# Altium schematic sheet [10]-I2C-Switch.SchDoc: I²C-Switch
size A3; Organization: Toradex AG; Address1: Altsagenstrasse 5; Address2: Horw; Address3: 6048; Address4: Switzerland; DocumentNumber: 9; Revision: V3.2; SheetNumber: 9; SheetTotal: 13; PageSetup: Record=PageOptions|CenterHorizontal=True|CenterVertical=True|PrintScale=0.73|XCorrection=1.00|YCorrection=1.00|PrintKind=0|BorderSize=5000000|LeftOffset=0|BottomOffset=0|Orientation=2|PaperLength=1000|PaperWidth=1000|Scale=100|PaperSource=7|PrintQuality=-4|MediaType=1|DitherType=10|PaperKind=A4|PrintScaleMode=1
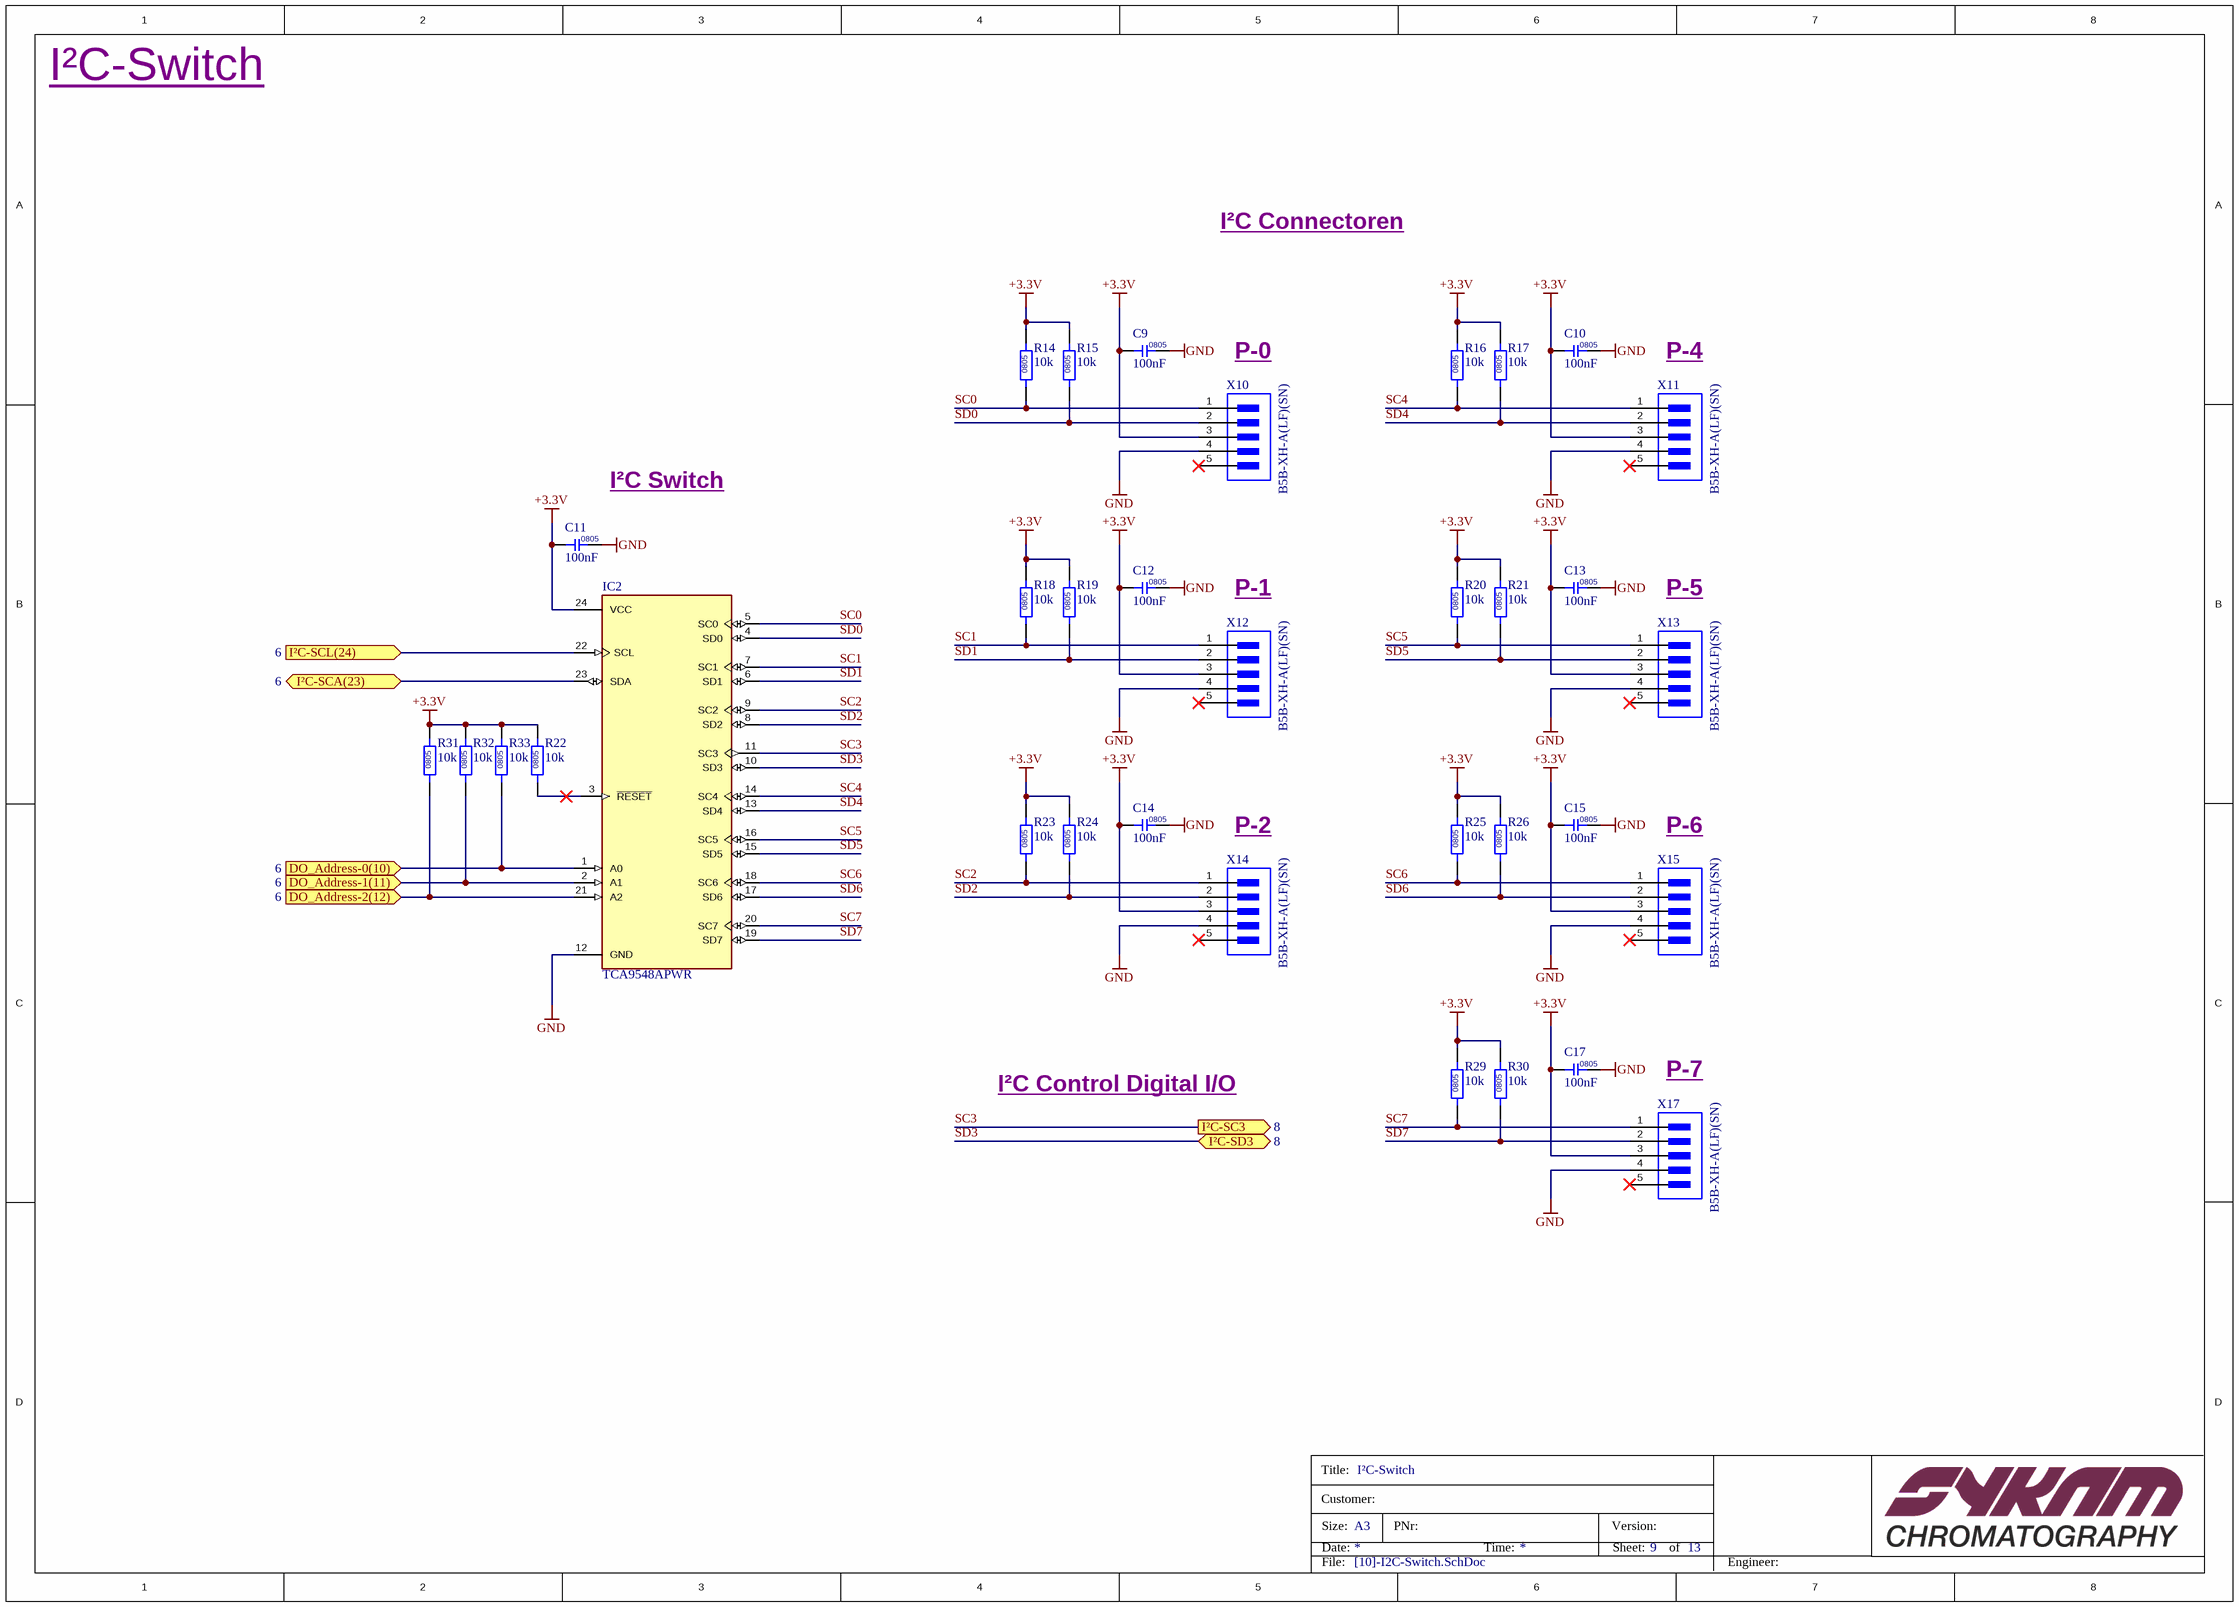
[diagram p0: [10]-I2C-Switch.SchDoc]

## Parts
C9  100nF  [C0805]
C10  100nF  [C0805]
C11  100nF  [C0805]
C12  100nF  [C0805]
C13  100nF  [C0805]
C14  100nF  [C0805]
C15  100nF  [C0805]
C17  100nF  [C0805]
IC2  TCA9548APWR  [IC-TCA9548-TSSOP24]
R14  10k  [R0805]
R15  10k  [R0805]
R16  10k  [R0805]
R17  10k  [R0805]
R18  10k  [R0805]
R19  10k  [R0805]
R20  10k  [R0805]
R21  10k  [R0805]
R22  10k  [R0805]
R23  10k  [R0805]
R24  10k  [R0805]
R25  10k  [R0805]
R26  10k  [R0805]
R29  10k  [R0805]
R30  10k  [R0805]
R31  10k  [R0805]
R32  10k  [R0805]
R33  10k  [R0805]
X10  B5B-XH-A(LF)(SN)  [CON_ B5B-XH-A (LF)(SN)]
X11  B5B-XH-A(LF)(SN)  [CON_ B5B-XH-A (LF)(SN)]
X12  B5B-XH-A(LF)(SN)  [CON_ B5B-XH-A (LF)(SN)]
X13  B5B-XH-A(LF)(SN)  [CON_ B5B-XH-A (LF)(SN)]
X14  B5B-XH-A(LF)(SN)  [CON_ B5B-XH-A (LF)(SN)]
X15  B5B-XH-A(LF)(SN)  [CON_ B5B-XH-A (LF)(SN)]
X17  B5B-XH-A(LF)(SN)  [CON_ B5B-XH-A (LF)(SN)]

## Ports
DO_Address-0(10) (in, see 6), DO_Address-1(11) (in, see 6), DO_Address-2(12) (in, see 6), I²C-SC3 (out, see 8), I²C-SCA(23) (bidir, see 6), I²C-SCL(24) (in, see 6), I²C-SD3 (bidir, see 8)

## Nets
+3.3V: C9.1 C10.1 C11.1 C12.1 C13.1 C14.1 C15.1 C17.1 IC2.24(VCC) R14.2 R15.2 R16.2 R17.2 R18.2 R19.2 R20.2 R21.2 R22.2 R23.2 R24.2 R25.2 R26.2 R29.2 R30.2 R31.2 R32.2 R33.2 X10.3 X11.3 X12.3 X13.3 X14.3 X15.3 X17.3
GND: C9.2 C10.2 C11.2 C12.2 C13.2 C14.2 C15.2 C17.2 IC2.12(GND) X10.4 X11.4 X12.4 X13.4 X14.4 X15.4 X17.4
DO_Address-0(10): IC2.1(A0) R33.1 ; port DO_Address-0(10)
DO_Address-1(11): IC2.2(A1) R32.1 ; port DO_Address-1(11)
DO_Address-2(12): IC2.21(A2) R31.1 ; port DO_Address-2(12)
I²C-SCA(23): IC2.23(SDA) ; port I²C-SCA(23)
I²C-SCL(24): IC2.22(SCL) ; port I²C-SCL(24)
SC0: IC2.5(SC0) R14.1 X10.1
SC1: IC2.7(SC1) R18.1 X12.1
SC2: IC2.9(SC2) R23.1 X14.1
SC3: IC2.11(SC3) ; port I²C-SC3
SC4: IC2.14(SC4) R16.1 X11.1
SC5: IC2.16(SC5) R20.1 X13.1
SC6: IC2.18(SC6) R25.1 X15.1
SC7: IC2.20(SC7) R29.1 X17.1
SD0: IC2.4(SD0) R15.1 X10.2
SD1: IC2.6(SD1) R19.1 X12.2
SD2: IC2.8(SD2) R24.1 X14.2
SD3: IC2.10(SD3) ; port I²C-SD3
SD4: IC2.13(SD4) R17.1 X11.2
SD5: IC2.15(SD5) R21.1 X13.2
SD6: IC2.17(SD6) R26.1 X15.2
SD7: IC2.19(SD7) R30.1 X17.2
NetIC2_3: IC2.3(~{RESET}) R22.1

Not connected (* = marked no-connect by the designer): X10 5*; X11 5*; X12 5*; X13 5*; X14 5*; X15 5*; X17 5*

## Notes on the sheet
- I²C Connectoren
- (near X10) P-0
- (near X11) P-4
- (near C11) I²C Switch
- (near X12) P-1
- (near X13) P-5
- (near X14) P-2
- (near X15) P-6
- I²C Control Digital I/O
- (near X17) P-7
- Title:
- Customer:
- Size:
- Date:
- A3
- PNr:
- Time:
- Version:
- Sheet:
- of
- File:
- Engineer:
- Title
- Number:
- Revision:
- Sheet

## Library data of the parts
C9-C15 C17 = C_100nF_CC0805KRX7R9BB104: CAP CER 0.1UF 50V X7R 0805; Manufacturer: Yageo; Material: Ceramic; Tolerance: 10%; Insulation Resistance: 100GR; PCBChecked: initials after Checked; Supplier 1: Digi-Key; Manufacturer Part Number: CC0805KRX7R9BB104; RoHS: Yes; Category: Ceramic Capacitors; Mount: Surface Mount; Case/Package: 0805; Number of Pins: 2; Case Code (Metric): 2012; Case Code (Imperial): 0805; Min Operating Temperature: -55°C; Max Operating Temperature: 125°C; Packaging: Tape and Reel; Capacitance: 100nF; Voltage Rating: 50V; Package Quantity: 1; Dielectric: X7R; Termination: SMD/SMT; Voltage: 50V; Length: 2mm; Height: 0.85mm; Width: 0.049inch; Thickness: 0.033inch; Depth: 1.25mm; Radiation Hardening: No; REACH SVHC: No SVHC; Lead Free: Lead Free; Halogen Free: Halogen Free; ComponentLink1URL: https://datasheet.ciiva.com/11786/0900766b80d84f1d-11786009.pdf?src-supplier=RSComponents; ComponentLink1Description: https://datasheet.ciiva.com/11786/0900766b80d84f1d-11786009.pdf?src-supplier=RSComponents; ComponentLink2URL: https://datasheet.ciiva.com/11464/upy-gphc-x7r-6-3v-to-50v-8-11464757.pdf?src-supplier=Avnet; ComponentLink2Description: https://datasheet.ciiva.com/11464/upy-gphc-x7r-6-3v-to-50v-8-11464757.pdf?src-supplier=Avnet; ComponentLink3URL: https://datasheet.ciiva.com/28450/1489800-28450805.pdf?src-supplier=Element14; ComponentLink3Description: https://datasheet.ciiva.com/28450/1489800-28450805.pdf?src-supplier=Element14; ComponentLink4URL: https://datasheet.ciiva.com/155/mlccorderingcode-155929.pdf?src-supplier=Digi-Key; ComponentLink4Description: https://datasheet.ciiva.com/155/mlccorderingcode-155929.pdf?src-supplier=Digi-Key; ComponentLink5URL: https://datasheet.ciiva.com/155/mlccorderingcode-155930.pdf?src-supplier=Digi-Key; ComponentLink5Description: https://datasheet.ciiva.com/155/mlccorderingcode-155930.pdf?src-supplier=Digi-Key; ComponentLink6URL: https://datasheet.ciiva.com/155/mlccorderingcode-155931.pdf?src-supplier=Digi-Key; ComponentLink6Description: https://datasheet.ciiva.com/155/mlccorderingcode-155931.pdf?src-supplier=Digi-Key; ComponentLink7URL: https://datasheet.ciiva.com/46393/1734573-46393307.pdf?src-supplier=Element14; ComponentLink7Description: https://datasheet.ciiva.com/46393/1734573-46393307.pdf?src-supplier=Element14; ComponentLink8URL: https://datasheet.ciiva.com/16625/upy-gphc-x7r-6-3v-to-50v-8-16625549.pdf?src-supplier=Avnet+Europe; ComponentLink8Description: https://datasheet.ciiva.com/16625/upy-gphc-x7r-6-3v-to-50v-8-16625549.pdf?src-supplier=Avnet+Europe; ComponentLink9URL: https://datasheet.ciiva.com/29242/445210-da-01-en-kerko-chip-0805-x7r-0-1uf-10proz-50vg-29242074.pdf?src-supplier=Conrad; ComponentLink9Description: https://datasheet.ciiva.com/29242/445210-da-01-en-kerko-chip-0805-x7r-0-1uf-10proz-50vg-29242074.pdf?src-supplier=Conrad; Supplier Part Number 1: 311-1140-6-ND; Stock 1: 7118979; IPC7352C: done; SCHChecked: Initials after checked
IC2 = IC_TCA9548APWR: IC I2C SW 8CH W/RESET 24TSSOP; Manufacturer: Texas Instruments; Supply Type: Single; Independent Circuits: 1; Max Supply Voltage: 5.5V; Min Supply Voltage: 1.65V; On-State Resistance: 70R; Max Supply Current: 80uA; Supplier 1: Mouser; Manufacturer Part Number: TCA9548APWR; RoHS: Yes; Category: Decoders and Multiplexers; Stock 1: 4104; Mount: Surface Mount; Case/Package: TSSOP; Number of Pins: 24; Contact Plating: Gold; Min Operating Temperature: -40°C; Max Operating Temperature: 85°C; Packaging: Tape and Reel; Package Quantity: 2000; Series: TCA; RoHS Compliant: Yes; Lead Free: Lead Free; Reach SVHC Compliant: Yes; ComponentLink1URL: https://datasheet.ciiva.com/6614/tca9548a-6614721.pdf?src-supplier=Digi-Key; ComponentLink1Description: https://datasheet.ciiva.com/6614/tca9548a-6614721.pdf?src-supplier=Digi-Key; Supplier Part Number 1: 595-TCA9548APWR
R14-R26 R29-R33 = R_10k_RC0805FR-0710KL: RES SMD 10K OHM 1% 1/8W 0805; Manufacturer: Yageo; Temperature Coefficient: 100ppm/°C; Resistance: 10kR; Power Rating: 125mW; Voltage Rating: 150V; PCBChecked: initials after Checked; Supplier 1: Digi-Key; Manufacturer Part Number: RC0805FR-0710KL; RoHS: Yes; Category: Chip SMD Resistors; Case/Package: 0805; Case Code (Imperial): 0805; Case Code (Metric): 2012; Min Operating Temperature: -55°C; Max Operating Temperature: 155°C; Packaging: Tape and Reel; Tolerance: 1%; Composition: Thick Film; Features: Moisture Resistant; Termination: SMD/SMT; Number of Terminations: 2; Military Standard: Not; Max Power Dissipation: 125mW; Package Quantity: 1; Length: 2mm; Height: 0.024inch; Width: 0.049inch; Depth: 1.25mm; Lead Free: Lead Free; REACH SVHC: Unknown; ComponentLink1URL: https://datasheet.ciiva.com/11808/0900766b8106beab-11808151.pdf?src-supplier=RSComponents; ComponentLink1Description: https://datasheet.ciiva.com/11808/0900766b8106beab-11808151.pdf?src-supplier=RSComponents; ComponentLink2URL: https://datasheet.ciiva.com/12669/rc0805-12669688.pdf?src-supplier=Mouser; ComponentLink2Description: https://datasheet.ciiva.com/12669/rc0805-12669688.pdf?src-supplier=Mouser; ComponentLink3URL: https://datasheet.ciiva.com/2456/pyu-r-int-thick-7-2456973.pdf?src-supplier=Digi-Key; ComponentLink3Description: https://datasheet.ciiva.com/2456/pyu-r-int-thick-7-2456973.pdf?src-supplier=Digi-Key; ComponentLink4URL: https://datasheet.ciiva.com/16747/rc0805-16747087.pdf?src-supplier=Future+Electronics; ComponentLink4Description: https://datasheet.ciiva.com/16747/rc0805-16747087.pdf?src-supplier=Future+Electronics; ComponentLink5URL: https://datasheet.ciiva.com/46447/444164-46447563.pdf?src-supplier=Element14; ComponentLink5Description: https://datasheet.ciiva.com/46447/444164-46447563.pdf?src-supplier=Element14; ComponentLink6URL: https://datasheet.ciiva.com/2456/pyu-r-int-thick-7-2456972.pdf?src-supplier=Digi-Key; ComponentLink6Description: https://datasheet.ciiva.com/2456/pyu-r-int-thick-7-2456972.pdf?src-supplier=Digi-Key; ComponentLink7URL: https://datasheet.ciiva.com/2456/pyu-r-int-thick-7-2456974.pdf?src-supplier=Digi-Key; ComponentLink7Description: https://datasheet.ciiva.com/2456/pyu-r-int-thick-7-2456974.pdf?src-supplier=Digi-Key; Supplier Part Number 1: 311-10.0KCRCT-ND; Stock 1: 31284302; IPC7352C: done; SCHChecked: Initials after checked
X10-X15 X17 = CON_5p_B5B-XH-A(LF)(SN): Conn Shrouded Header HDR 5 POS 2.5mm Solder ST Thru-Hole Box; Manufacturer: JST; Contact Resistance: 20mR; Current Rating: 3A; Number of Positions: 5; Max Voltage Rating (AC): 250V; Connector Type: Male Pin; Insulation Resistance: 1GR; Gender: Male; Wire/Cable Gauge: 22AWG; Supplier 1: Farnell; Manufacturer Part Number: B5B-XH-A(LF)(SN); RoHS: Yes; Category: Headers and Wire Housings; Stock 1: 68330; Pricing 1: 100=0,14500, 500=0,12300, 1000=0,10000, 2500=0,09460, 5000=0,08910, 10000=0,08060 (EUR); Mount: Through Hole; Contact Material: Brass; Color: Natural; Contact Plating: Tin,Lead,Copper; Housing Color: White; Housing Material: Polyamide; Min Operating Temperature: -25°C; Max Operating Temperature: 85°C; Number of Rows: 1; Packaging: Bulk; Max Current Rating: 3A; Termination: Press-Fit; Fastening Type: Detent; Orientation: Straight; Voltage Rating (AC): 250V; Voltage Rating: 250V; Number of Contacts: 5; Length: 14.9mm; Pitch: 2.5mm; Depth: 5.75mm; Lead Pitch: 2.5mm; Lead Free: Lead Free; REACH SVHC: No SVHC; ComponentLink1URL: https://datasheet.ciiva.com/11746/0900766b8082f55f-11746654.pdf?src-supplier=RSComponents; ComponentLink1Description: https://datasheet.ciiva.com/11746/0900766b8082f55f-11746654.pdf?src-supplier=RSComponents; ComponentLink2URL: https://datasheet.ciiva.com/26894/getdatasheetpartid-455618-26894798.pdf?src-supplier=Verical; ComponentLink2Description: https://datasheet.ciiva.com/26894/getdatasheetpartid-455618-26894798.pdf?src-supplier=Verical; ComponentLink3URL: https://datasheet.ciiva.com/26894/getdatasheetpartid-640991-26894479.pdf?src-supplier=Verical; ComponentLink3Description: https://datasheet.ciiva.com/26894/getdatasheetpartid-640991-26894479.pdf?src-supplier=Verical; ComponentLink4URL: https://datasheet.ciiva.com/724/exh-724390.pdf?src-supplier=Digi-Key; ComponentLink4Description: https://datasheet.ciiva.com/724/exh-724390.pdf?src-supplier=Digi-Key; ComponentLink5URL: https://datasheet.ciiva.com/20207/523653-20207174.pdf?src-supplier=Rapid+Electronics; ComponentLink5Description: https://datasheet.ciiva.com/20207/523653-20207174.pdf?src-supplier=Rapid+Electronics; ComponentLink6URL: https://datasheet.ciiva.com/8052/1684882-8052063.pdf?src-supplier=Element14; ComponentLink6Description: https://datasheet.ciiva.com/8052/1684882-8052063.pdf?src-supplier=Element14; Supplier Part Number 1: 1516281